# EAGLE design Modulo display (EAGLE 4.14)
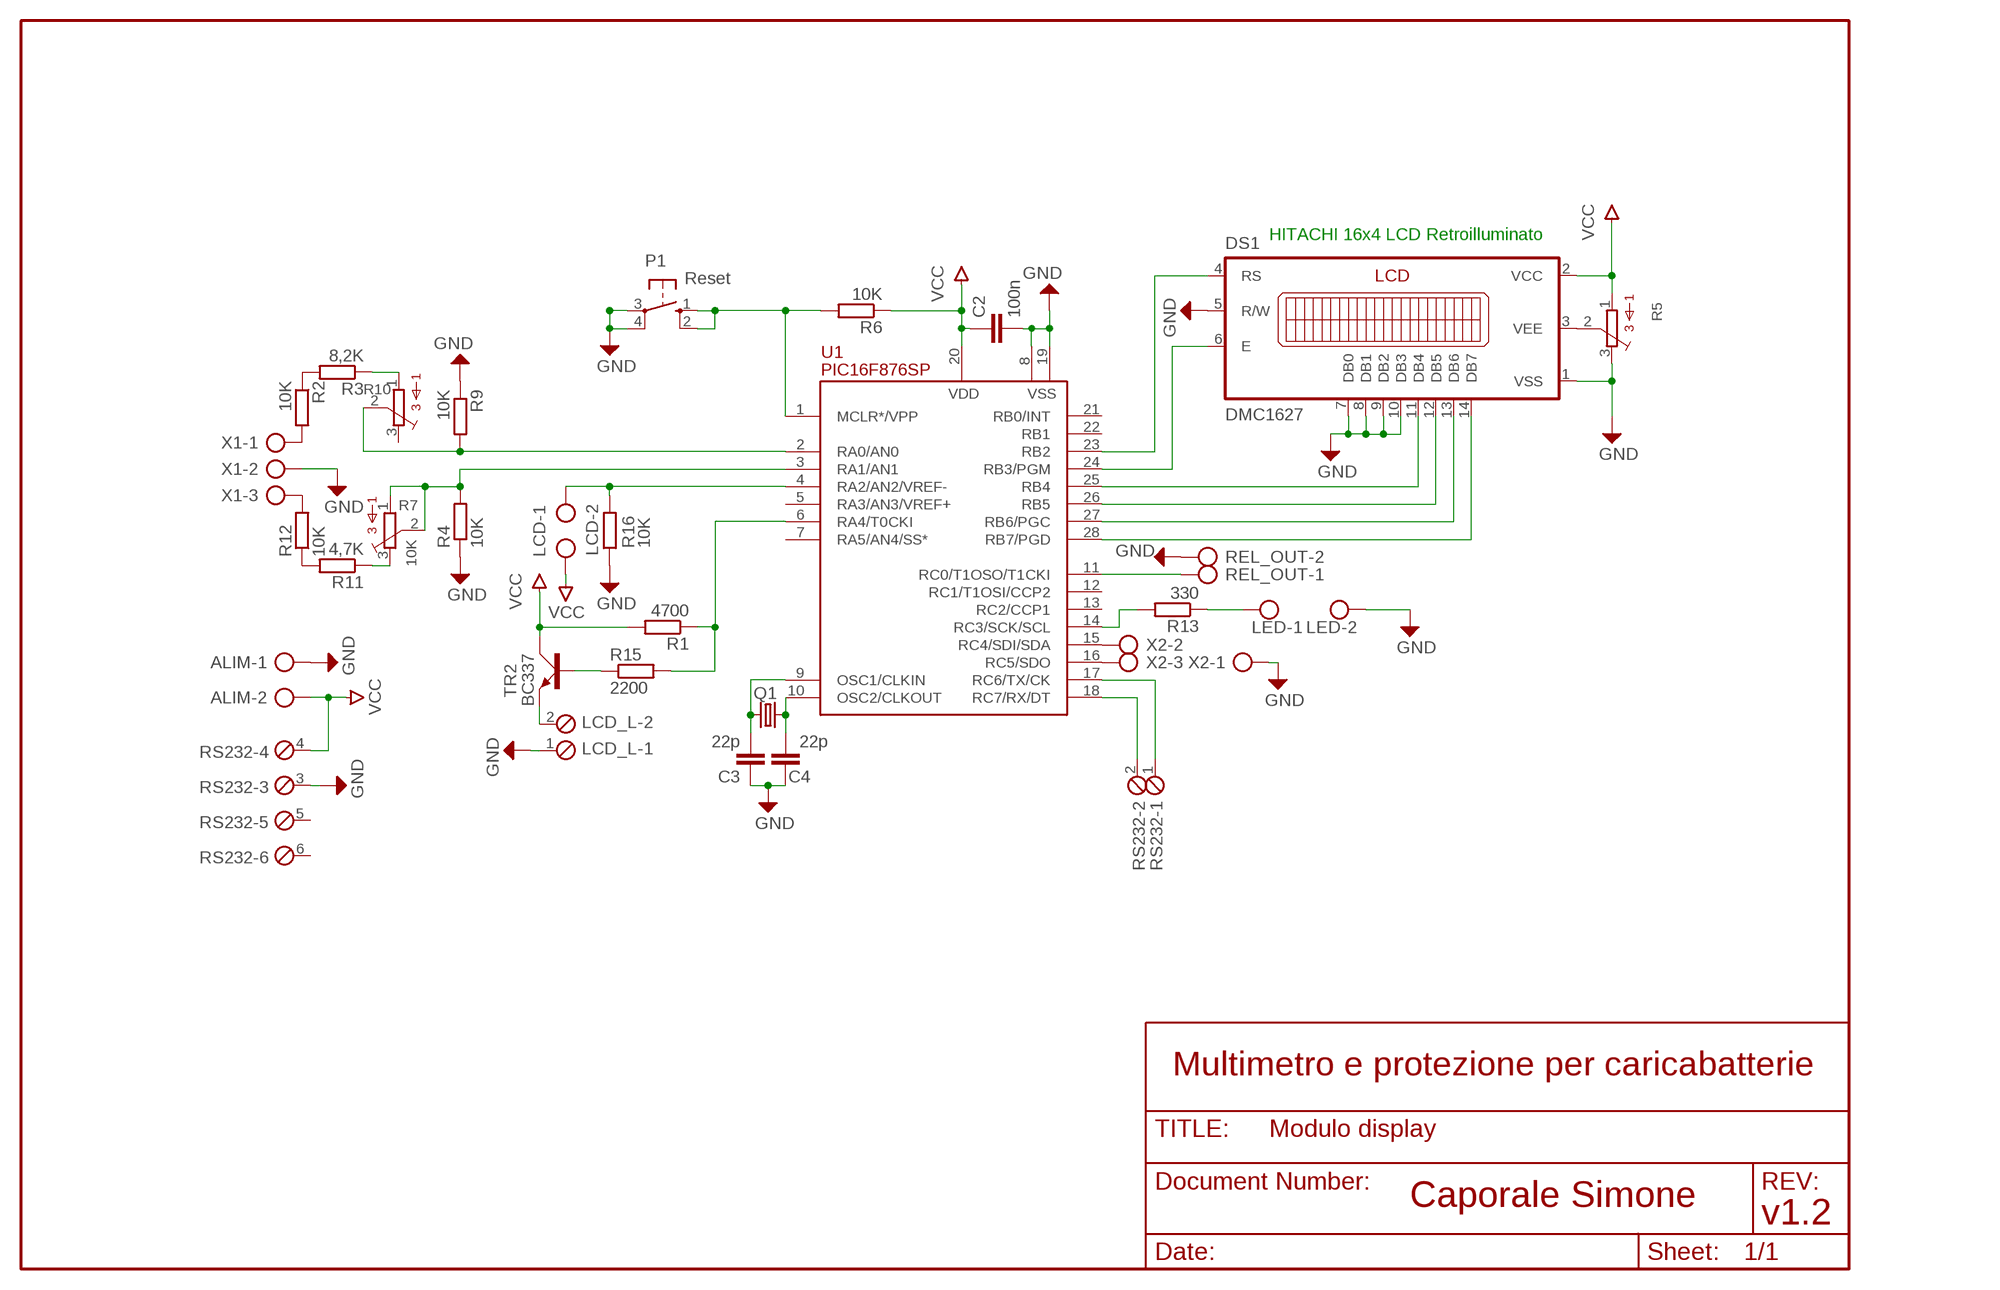
[diagram p0: schematic, sheet 1]

## Parts
ALIM  AK300/2  [AK300/2]
C2  100n  C5/2.5  [C5B2.5]
C3  22p  C2.5/2  [C2.5-2]
C4  22p  C2.5/2  [C2.5-2]
DS1  DMC1627  [DMC1627]
LCD  AK300/2  [AK300/2]
LCD_L  MPT2  [2POL254]
LED  AK300/2  [AK300/2]
P1  Reset  10-XX  [B3F-10XX]
Q1  CRYTALHC49S  [HC49/S]
R1  4700  R-EU_0309/12  [0309/12]
R2  10K  R-EU_0309/12  [0309/12]
R3  8,2K  R-EU_0309/12  [0309/12]
R4  10K  R-EU_0309/12  [0309/12]
R5  3386-G  [3386G]
R6  10K  R-EU_0309/12  [0309/12]
R7  10K  3386-G  [3386G]
R9  10K  R-EU_0309/12  [0309/12]
R10  3386-G  [3386G]
R11  4,7K  R-EU_0309/12  [0309/12]
R12  10K  R-EU_0309/12  [0309/12]
R13  330  R-EU_0309/12  [0309/12]
R15  2200  R-EU_0309/12  [0309/12]
R16  10K  R-EU_0309/12  [0309/12]
REL_OUT  AK300/2  [AK300/2]
RS232  MPT6  [6POL254]
TR2  BC337  [SOT54A]
U1  PIC16F876SP  [DIL28-3]
X1  AK300/3  [AK300/3]
X2  AK300/3  [AK300/3]

## Nets
GND: ALIM.1 C2.2 C3.1 C4.1 DS1.1(VSS) DS1.5(R/W) DS1.7(DB0) DS1.8(DB1) DS1.9(DB2) DS1.10(DB3) LCD_L.1 LED.2 P1.3(P) P1.4(P1) R4.1 R5.3 R9.1 R16.1 REL_OUT.2 RS232.3 U1.8(VSS) U1.19(VSS) X1.2 X2.1
N$1: R4.2 R7.1 R7.2 U1.3(RA1/AN1)
N$2: DS1.3(VEE) R5.2
N$4: DS1.14(DB7) U1.28(RB7/PGD)
N$5: R2.1 R3.2
N$6: U1.16(RC5/SDO) X2.3
N$7: DS1.13(DB6) U1.27(RB6/PGC)
N$8: DS1.12(DB5) U1.26(RB5)
N$9: DS1.11(DB4) U1.25(RB4)
N$10: DS1.4(RS) U1.23(RB2)
N$11: DS1.6(E) U1.24(RB3/PGM)
N$12: P1.1(S) P1.2(S1) R6.2 U1.1(MCLR*/VPP)
N$13: RS232.2 U1.18(RC7/RX/DT)
N$14: C3.2 Q1.2 U1.9(OSC1/CLKIN)
N$15: C4.2 Q1.1 U1.10(OSC2/CLKOUT)
N$16: RS232.1 U1.17(RC6/TX/CK)
N$17: R9.2 R10.2 U1.2(RA0/AN0)
N$18: R3.1 R10.1
N$19: U1.15(RC4/SDI/SDA) X2.2
N$20: R11.2 R12.1
N$21: R12.2 X1.3
N$22: R2.2 X1.1
N$23: R1.1 R15.2 U1.6(RA4/T0CKI)
N$24: R13.2 U1.14(RC3/SCK/SCL)
N$25: LED.1 R13.1
N$28: R15.1 TR2.B
N$29: LCD_L.2 TR2.E
N$30: ALIM.2 C2.1 DS1.2(VCC) LCD.1 R1.2 R5.1 R6.1 RS232.4 TR2.C U1.20(VDD) ; supply symbol labelled VCC
N$31: LCD.2 R16.2 U1.4(RA2/AN2/VREF-)
N$32: REL_OUT.1 U1.11(RC0/T1OSO/T1CKI)
N$36: R7.3 R11.1
Unconnected: R10.3 RS232.5 RS232.6 U1.5(RA3/AN3/VREF+) U1.7(RA5/AN4/SS*) U1.12(RC1/T1OSI/CCP2) U1.13(RC2/CCP1) U1.21(RB0/INT) U1.22(RB1)

## Notes on the sheet
- HITACHI 16x4 LCD Retroilluminato
- Multimetro e protezione per caricabatterie
- Caporale Simone
- v1.2

## Library data of the parts
ALIM LCD LED REL_OUT = con-ptr500:AK300/2: CONNECTOR
C2-C4 = capacitor-wima:C: CAPACITOR naming: grid - package width
DS1 = display-lcd:DMC1627: LCD DISPLAY Optrex, 16 characters x 2 Lines
LCD_L = con-phoenix-254:MPT2: PHOENIX CONNECTOR
P1 = switch-omron:10-XX: OMRON SWITCH
Q1 = crystal:CRYTAL: CRYSTAL
R1-R4 R6 R9 R11-R13 R15 R16 = rcl:R-EU_: RESISTOR, European symbol
R5 R7 R10 = BOURNS:3386-: 3386 Series 3/8" Square Trimmer
RS232 = con-phoenix-254:MPT6: PHOENIX CONNECTOR
TR2 = transistor-small-signal:BC337: NPN TRANSISTOR
U1 = pic16f87x:PIC16F876: FLASH MICROCONTROLLER
X1 X2 = con-ptr500:AK300/3: CONNECTOR

## Net classes
0 default: width 0.406 mm, clearance 0.61 mm

## Board
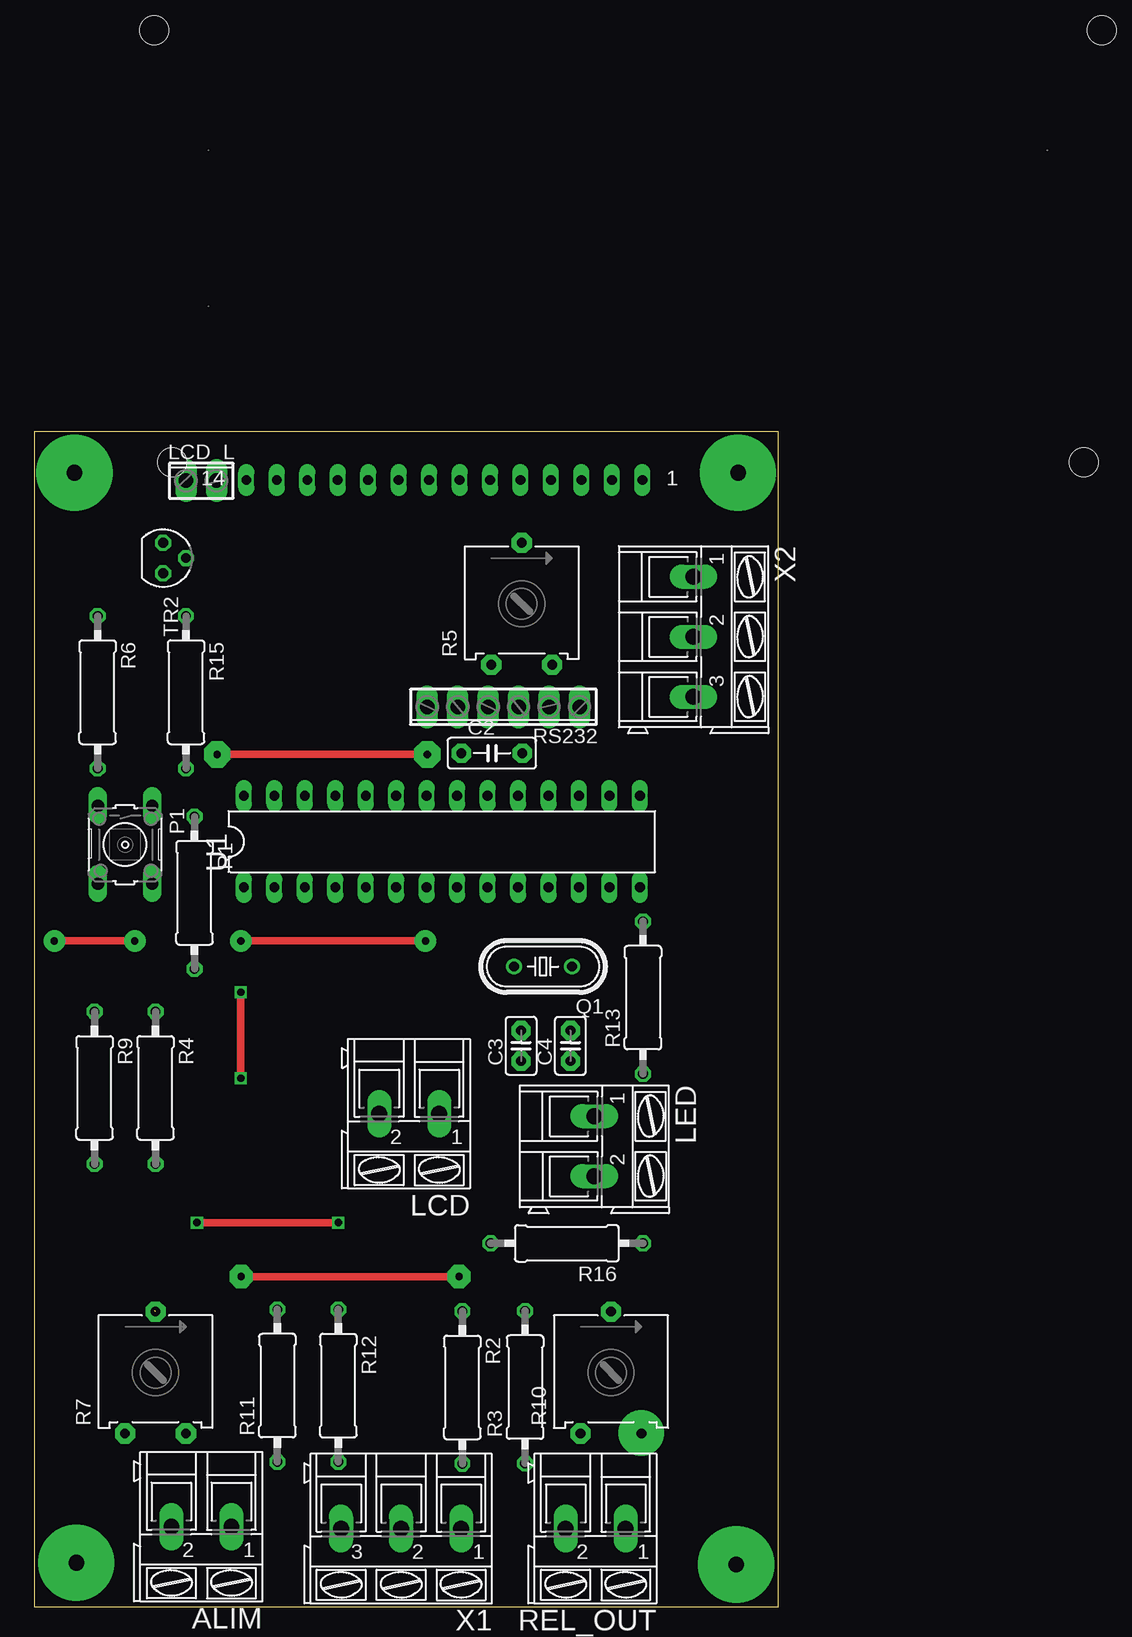
[diagram p1: board, top side]
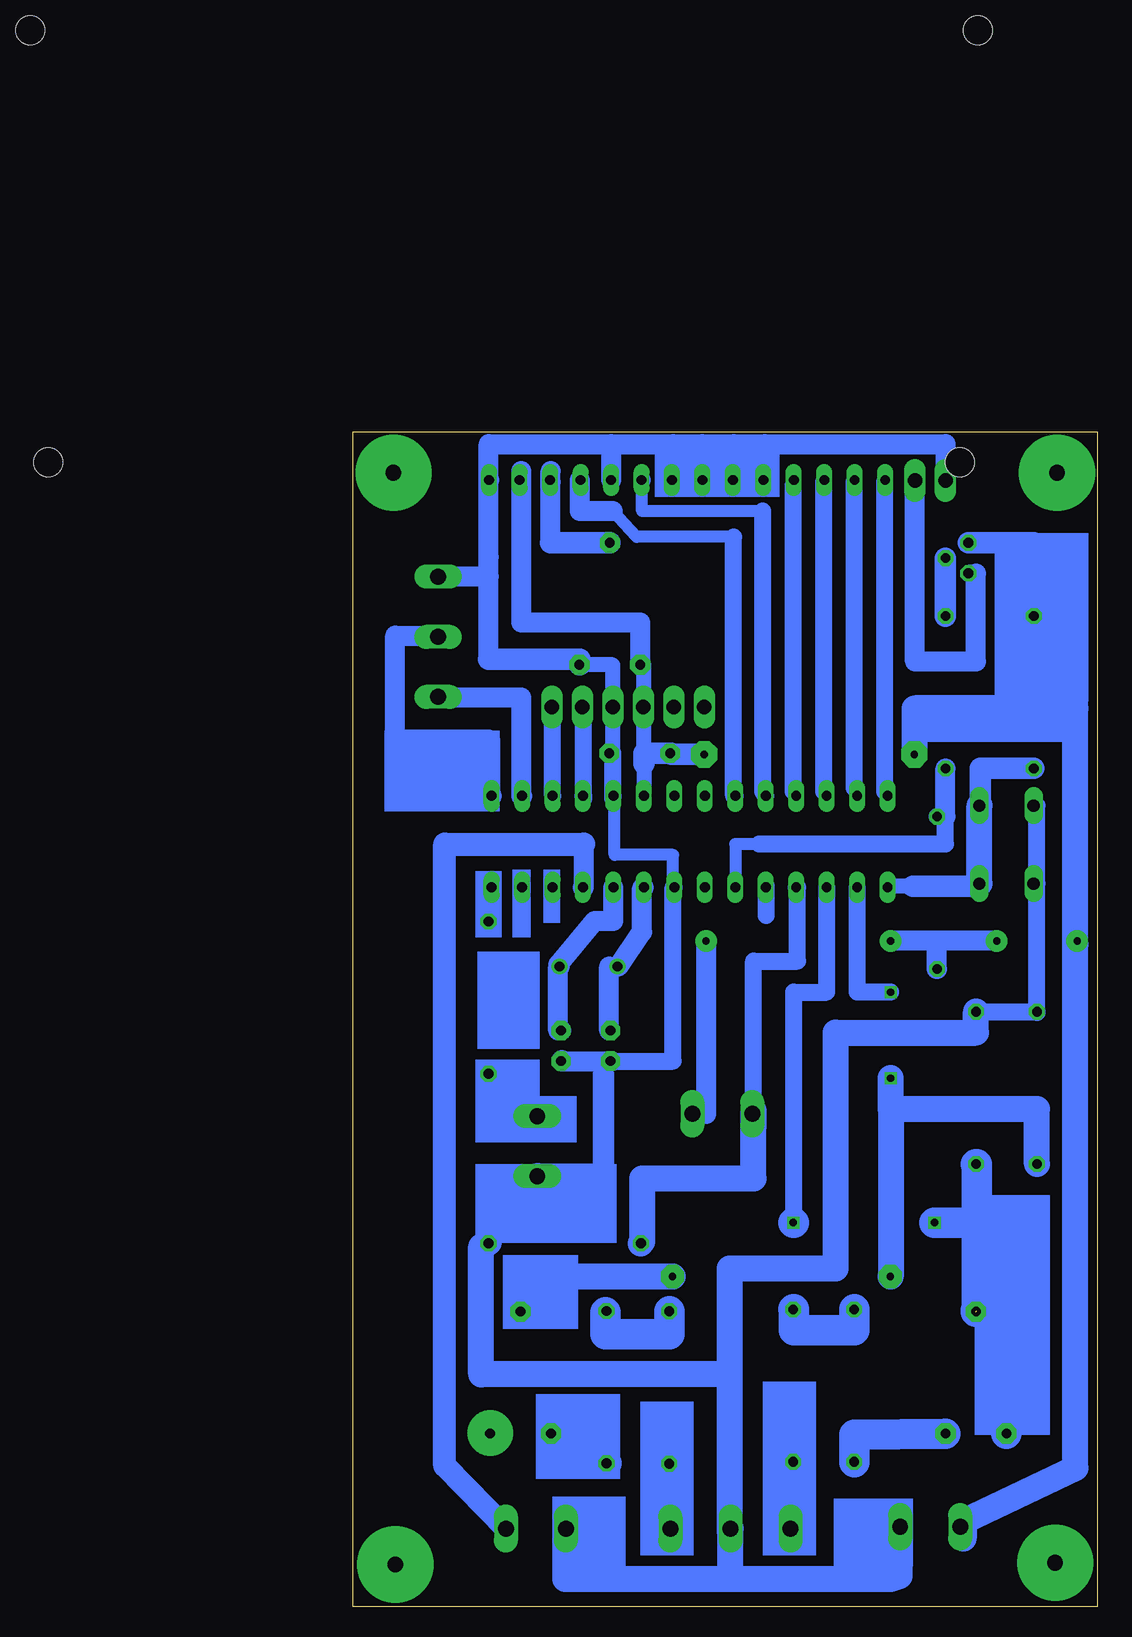
[diagram p2: board, bottom side, seen from below]

Size 62.06 x 97.92 mm. Coordinates in mm from the lower left corner, seen from the top.
Outline: 0,0 62.06,0 62.06,97.92 0,97.92 0,0
Copper layers (1*16): Top 0.035mm / dielectric 1.5mm / Bottom 0.035mm
Design rules "default": minimum track width 20mil, minimum drill 24mil, track to track 8mil, track to pad 8mil, pad to pad 8mil, via to via 8mil, smd to smd 8mil, copper to edge 40mil, drill to drill 8mil, minimum pad ring 10mil, minimum via ring 8mil, stop-mask expansion 4mil, vias tented up to drill 0mil, thermal gap 10mil

### Footprints (pad centres in the part's own frame; a part is rotated, then mirrored left to right if it is on the bottom)
AK300/2 = drill 1.321 long: 1 -2.515,0; 2 2.489,0
C5B2.5 = drill 0.813 pad 1.6 octagon: 1 -2.54,0; 2 2.54,0
C2.5-2 = drill 0.813 pad 1.6 octagon: 1 -1.27,0; 2 1.27,0
DMC1627 = drill 0.813 long: 1 1.22,-19.5; 2 -1.32,-19.5; 3 -3.86,-19.5; 4 -6.4,-19.5; 5 -8.94,-19.5; 6 -11.48,-19.5; 7 -14.02,-19.5; 8 -16.56,-19.5; 9 -19.1,-19.5; 10 -21.64,-19.5; 11 -24.18,-19.5; 12 -26.72,-19.5; 13 -29.26,-19.5; 14 -31.8,-19.5 | hole 2.4: -39.5,18; -38,-18; 38,-18; 39.5,18
2POL254 = drill 1.2 long: 1 -1.27,0; 2 1.27,0
B3F-10XX = drill 1.016 long: 1 -3.251,2.261; 2 3.251,2.261; 3 -3.251,-2.261; 4 3.251,-2.261
HC49/S = drill 0.813 round: 1 -2.413,0; 2 2.413,0
0309/12 = drill 0.813 octagon: 1 -6.35,0; 2 6.35,0
3386G = drill 0.813 pad 1.676 octagon: 1 -2.54,-5.08; 2 0,5.08; 3 2.54,-5.08
6POL254 = drill 1.2 pad 1.778 long: 1 -6.35,0; 2 -3.81,0; 3 -1.27,0; 4 1.27,0; 5 3.81,0; 6 6.35,0
SOT54A = drill 0.813 octagon: B 0,1.905; C -1.27,0; E 1.27,0
DIL28-3 = drill 0.813 long: 1 -16.51,-3.81; 2 -13.97,-3.81; 3 -11.43,-3.81; 4 -8.89,-3.81; 5 -6.35,-3.81; 6 -3.81,-3.81; 7 -1.27,-3.81; 8 1.27,-3.81; 9 3.81,-3.81; 10 6.35,-3.81; 11 8.89,-3.81; 12 11.43,-3.81; 13 13.97,-3.81; 14 16.51,-3.81; 15 16.51,3.81; 16 13.97,3.81; 17 11.43,3.81; 18 8.89,3.81; 19 6.35,3.81; 20 3.81,3.81; 21 1.27,3.81; 22 -1.27,3.81; 23 -3.81,3.81; 24 -6.35,3.81; 25 -8.89,3.81; 26 -11.43,3.81; 27 -13.97,3.81; 28 -16.51,3.81
AK300/3 = drill 1.321 long: 1 -5.004,0; 2 0,0; 3 5.004,0

### Placement (x,y rotation side)
ALIM  13.94,6.67 180 top
C2  38.17,71.13 0 top
C3  40.61,46.75 90 top
C4  44.72,46.75 90 top
DS1  49.5,113.4 0 top
LCD  31.26,41.08 180 top
LCD_L  13.94,93.84 0 top
LED  46.71,38.37 270 top
P1  7.59,63.51 270 top
Q1  42.44,53.35 180 top
R1  13.38,59.5 270 top
R2  35.71,18.28 270 top
R3  40.94,18.3 90 top
R4  10.13,43.24 270 top
R5  40.66,83.58 0 top
R6  5.3,76.21 270 top
R7  10.13,19.52 0 top
R9  5.05,43.24 270 top
R10  48.1,19.52 0 top
R11  20.29,18.43 90 top
R12  25.37,18.43 270 top
R13  50.77,50.76 90 top
R15  12.67,76.21 270 top
R16  44.42,30.29 180 top
REL_OUT  46.81,6.52 180 top
RS232  39.14,74.99 180 top
TR2  10.76,87.39 270 top
U1  34.01,63.77 0 top
X1  30.6,6.52 180 top
X2  54.99,80.84 270 top

### Tracks (layer width: path | path; a pad name or v marks a point on that pad's centre or on a via)
GND
  Bottom 0.508: LCD_L.1 12.67,93.71
  Bottom 1.016: U1.19 40.25,67.58 40.25,62.65 35.38,62.65 35.38,59.96 35.22,59.91
  Bottom 1.27: 43.15,78.5 40.41,78.5 RS232.3 40.41,71.13
  Bottom 1.422: 50.77,94.04 50.77,93.9 | 50.77,87.49 50.77,87.54 | R4.1 R9.1 | P1.3 5.05,66.76 5.05,60.26 | R9.1 5.05,49.54 | 5.05,60.26 P1.4 | R9.1 5.05,60.26 | 40.56,45.48 35.38,45.48 35.38,59.96 U1.8 | 40.56,71.03 C2.2 40.41,71.13 40.41,67.58 | 40.41,67.58 40.41,67.37 | U1.19 40.41,67.58 | 41.17,44.36 41.17,45.43
  Bottom 1.676: 40.56,96.89 50.77,96.89 50.77,93.89 | 40.56,96.89 35.38,96.89 | 35.38,96.89 32.94,96.89 | 32.94,96.89 30.35,96.89 | 30.35,96.89 27.76,96.89 | 27.76,96.89 12.67,96.89 LCD_L.1 | 50.77,30.34 R16.1 | 44.37,6.36 REL_OUT.2 | 16.48,2.55 16.48,2.91 | 30.35,2.3 30.5,2.3 30.65,2.3 | 50.77,78.96 50.77,85.84 | 50.77,93.89 50.77,87.49 50.77,85.84 | 50.77,93.89 50.77,94.04 | 46.65,35.83 46.65,35.88 LED.2 | 44.67,45.48 44.67,45.58 | C3.1 40.56,45.48 40.56,45.43 41.17,45.43 44.67,45.43 44.67,45.48 | 44.67,45.48 C4.1 | 50.77,93.89 50.77,93.9 DS1.1 | DS1.10 27.76,93.9 27.76,96.89 | DS1.9 30.35,93.9 30.35,96.89 | DS1.8 32.94,96.89 | DS1.7 35.38,93.9 35.38,96.89 | DS1.5 40.56,96.89 | 50.77,85.84 X2.1
  Bottom 1.778: X1.2 30.5,6.41 30.45,6.46 | 30.5,2.3 30.6,2.4 | 41.17,35.67 41.17,35.88 41.17,44.36 | R5.3 43.15,78.5 43.15,78.96 50.77,78.96
  Bottom 2.184: R4.1 10.13,47.84 21.81,47.84 21.81,28.21 30.65,28.21 30.65,19.37 | 44.37,6.36 44.37,2.3 30.65,2.3 | ALIM.1 16.48,2.55 17.24,2.3 30.35,2.3 | 46.65,35.83 50.77,35.83 50.77,30.34 51.38,30.04 51.38,19.37 30.65,19.37 | 46.65,35.88 41.17,35.88 | 30.6,2.4 X1.2 30.65,6.51 | 30.65,6.51 30.65,6.26 | 30.65,6.51 30.65,19.37
N$1  (via drill 0.6)  (1 unrouted)
  Top 0.61: v13.58,32.02 v25.37,32.02
  Bottom 1.422: U1.3 22.58,51.22 25.32,51.22 25.32,32.02
  Bottom 2.54: R7.2 10.13,24.7 7.59,24.7 R7.1 | R4.2 10.08,36.89 10.08,32.02 | 10.08,24.65 10.08,32.02 | 10.08,32.02 v13.58,32.02 | v25.37,32.02 25.32,32.02
N$2
  Bottom 1.422: 45.59,93.74 45.59,93.9 DS1.3
  Bottom 1.676: 45.59,88.66 45.59,93.74 45.59,94.65
  Bottom 1.778: R5.2 45.59,88.66
N$3  (via drill 1.3 pad 6.35)
  other vias: 58.54,3.52
N$4
  Bottom 0.508: U1.28 17.75,67.93 | 17.75,93.74 DS1.14
  Bottom 1.422: 17.75,67.93 17.75,93.74
N$5
  Bottom 2.184: 41.02,24.55 40.94,24.55 R3.2
  Bottom 2.54: R2.1 35.71,22.72 41.02,22.72 41.02,24.55
N$6
  Bottom 1.676: U1.16 48.03,67.58 48.03,75.76 54.88,75.76 54.88,75.83 X2.3
N$7
  Bottom 0.508: U1.27 20.29,68.24 | 20.29,93.74 DS1.13
  Bottom 1.422: 20.29,68.24 20.29,93.74
N$8
  Bottom 0.508: U1.26 22.83,67.93 | 22.83,93.74 DS1.12
  Bottom 1.422: 22.83,67.93 22.83,93.74
N$9
  Bottom 0.508: U1.25 25.37,67.93 | 25.37,93.43 DS1.11
  Bottom 1.422: 25.37,67.93 25.37,93.43
N$10
  Bottom 1.016: 30.35,89.17 38.43,89.17 40.41,91.3
  Bottom 1.422: U1.23 30.35,67.58 30.35,89.17 | 43.15,93.9 DS1.4
  Bottom 1.676: 40.41,91.3 43.15,91.3 43.15,93.9
N$11
  Bottom 1.016: 37.97,93.9 37.97,91.3 27.91,91.3
  Bottom 1.422: 27.91,83.98 27.91,67.93 U1.24 | 27.91,83.98 27.91,84.09 | 37.97,93.9 DS1.6 | 27.91,83.98 27.91,91.3
N$12
  Bottom 1.27: U1.1 17.39,59.96 17.39,60.06 15.41,60.06 | P1.1 9.77,66.76
  Bottom 1.676: P1.2 9.85,60.06
  Bottom 1.778: 9.85,60.06 15.41,60.06 | R6.2 9.77,69.86 9.77,66.76
  Bottom 2.184: P1.2 P1.1
N$13
  Bottom 1.422: 42.84,67.58 42.84,67.37 | U1.18 42.84,67.58 | RS232.2 42.84,74.99 42.84,67.58
N$14
  Bottom 1.676: U1.9 37.92,59.96 37.97,59.91 37.97,56.25 39.95,53.35 Q1.2 40.71,53.35 40.71,48.02 C3.2
N$15
  Bottom 1.676: U1.10 40.36,57.16 41.93,57.16 44.98,53.5 44.85,53.38 Q1.1 44.98,53.35 44.98,48.02 C4.2
N$16
  Bottom 1.422: RS232.1 45.44,74.99 U1.17
N$17  (via drill 0.6, 0.6 pad 1.93)
  Top 0.61: v17.27,27.52 v35.43,27.52 | v17.24,44.06 v17.24,51.22
  Bottom 1.27: v17.27,27.52 17.24,27.83
  Bottom 1.422: U1.2 20.04,51.22 v17.24,51.22
  Bottom 2.184: v35.43,27.52 45.11,27.52 | R9.2 5.05,41.47 17.24,41.47 | v17.27,27.52 17.24,27.52 17.24,41.47 | 17.24,41.47 v17.24,44.06
  Bottom 2.54: R10.2 48.1,24.55 45.11,24.55 45.11,27.52
N$18
  Bottom 2.54: R10.1 45.44,14.44 45.44,11.95 R3.1
N$19
  Bottom 1.676: U1.15 50.62,67.58 50.62,72.25 58.54,72.25 58.54,80.94 55.04,80.94 55.04,80.84 X2.2
N$20
  Bottom 2.184: 25.32,24.78 25.32,24.85
  Bottom 2.54: R11.2 20.29,23.02 25.32,23.02 25.32,24.78 R12.1
N$21
  Bottom 0.508: 25.37,5.7 X1.3
  Bottom 2.54: 25.37,5.7 R12.2
N$22
  Bottom 0.508: 35.73,11.44 R2.2 | 35.73,5.55 X1.1
  Bottom 2.54: 35.73,5.55 35.73,11.44
N$23
  Bottom 1.016: 30.2,59.91 U1.6 30.2,63.56 28.21,63.56
  Bottom 1.422: 28.21,63.56 12.67,63.56 12.67,65.85 R1.1
  Bottom 1.676: 12.67,65.85 R15.2
N$24
  Bottom 1.676: 50.77,59.96 U1.14
  Bottom 2.184: 50.77,60.21 50.77,59.96 R13.2
N$25
  Bottom 2.184: LED.1 50.77,40.88 R13.1
N$27  (via drill 0.6 pad 3.81)
  other vias: 50.62,14.49
N$28
  Bottom 1.778: R15.1 TR2.B
N$29
  Bottom 1.422: 10.13,86.12 TR2.E
  Bottom 1.676: LCD_L.2 15.21,78.75 10.13,78.75 10.13,86.12
N$30  (via drill 0.6 pad 1.78, 0.6 pad 2.18)
  Top 0.61: v15.26,71.03 v32.79,71.03 | v1.7,55.49 v8.4,55.49 | v17.24,55.49 v32.63,55.49
  Bottom 1.27: 37.82,70.27 U1.20 | R5.1 37.82,78.5 37.82,74.99 | 37.82,74.99 RS232.4 | 37.82,70.73 37.82,74.99
  Bottom 1.422: 48.03,94.04 48.03,93.9 DS1.2 | 15.26,74.99 15.26,74.87 15.21,74.87
  Bottom 1.676: 11.15,5.7 ALIM.2 | 48.03,94.65 48.03,94.04 48.03,82 38.12,82 R5.1 | R1.2 13.43,53.15 13.43,55.49 | v8.4,55.49 13.43,55.49 | 1.85,55.18 1.7,55.18 v1.7,55.49 | LCD.1 32.63,41.08 v32.63,55.49 | 13.43,55.49 v17.24,55.49
  Bottom 1.778: 1.85,82.56 R6.1 5.3,88.66 TR2.C | v32.79,71.03 35.53,71.03 35.53,71.13 C2.1 37.82,71.13 37.82,70.73 37.82,70.27
  Bottom 2.184: 11.15,5.7 11.15,7.12 1.85,11.54 1.85,55.18 1.85,74.87 | 1.85,74.87 1.85,82.56 | 1.85,74.87 15.21,74.87 | 15.26,74.87 v15.26,71.03
N$31
  Bottom 1.422: U1.4 25.01,59.96 25.01,53.81 28.67,53.81 28.67,41.31
  Bottom 1.676: 28.67,40.02 LCD.2
  Bottom 2.184: R16.2 37.97,30.44 37.97,35.67 28.67,35.67 28.67,41.31 28.67,40.02
N$32
  Bottom 1.676: U1.11 42.84,59.96 42.84,63.56 | 49.4,6.36 49.4,6.72 | 49.4,6.36 REL_OUT.1 | 49.4,6.36 49.25,6.41
  Bottom 1.93: 42.84,63.56 54.43,63.56 54.43,11.75 49.25,6.41
N$33  (via drill 1.3 pad 6.35)
  other vias: 3.37,94.5
N$34  (via drill 1.3 pad 6.35)
  other vias: 3.53,3.67
N$35  (via drill 1.3 pad 6.35)
  other vias: 58.69,94.5
N$36
  Bottom 2.54: 20.29,12.05 R11.1 20.29,14.34 R7.3
N$37
  Bottom 1.422: 27.6,57.62 27.6,60.06
(copper drawn outside any net)
  shapes: Bottom area x19